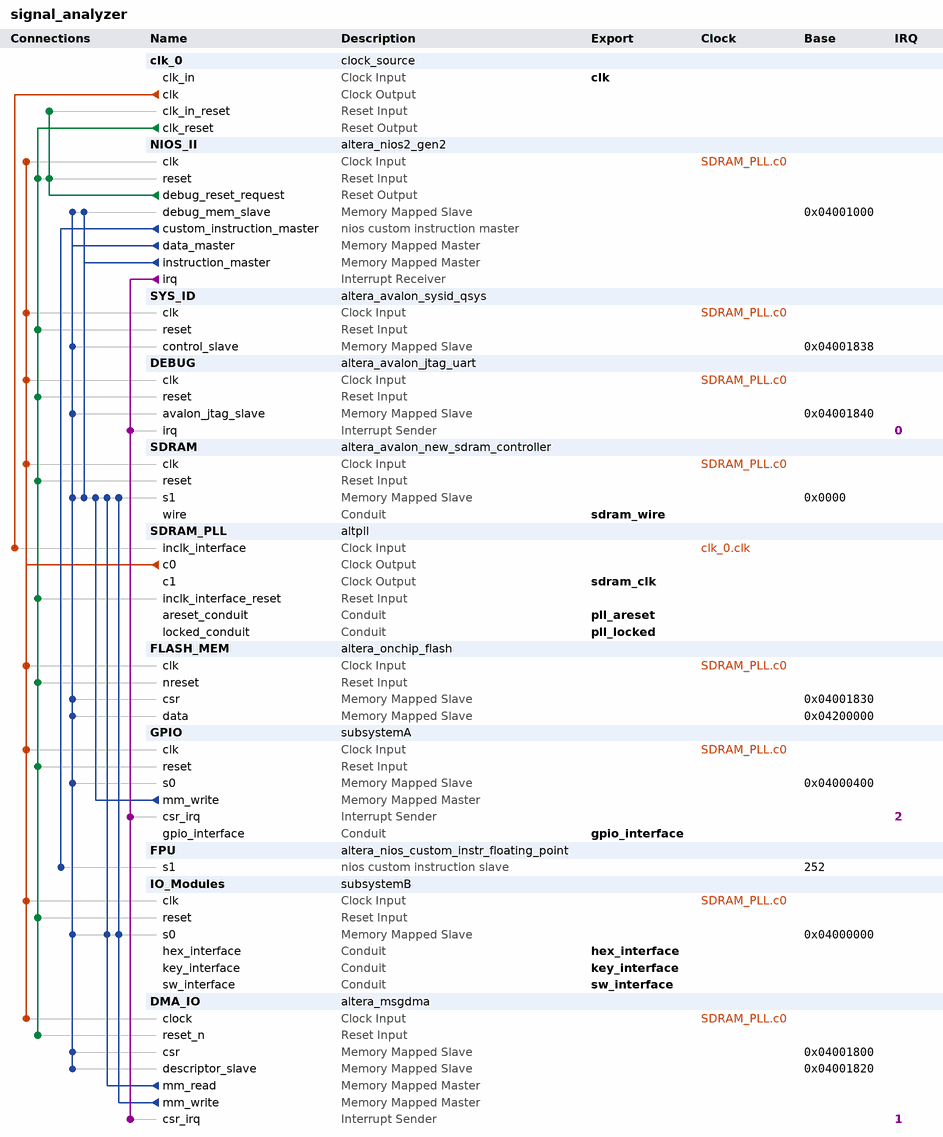
[diagram p0: system contents]
# Platform Designer (Qsys) system signal_analyzer, MAX 10 10M50DAF484C7G
# Parameters at their usual value, and those the tool derives, are not listed.
package require -exact qsys 18.1
create_system signal_analyzer
set_project_property DEVICE_FAMILY {MAX 10}
set_project_property DEVICE 10M50DAF484C7G

add_instance clk_0 clock_source 18.1
set_instance_parameter_value clk_0 clockFrequency 50000000

add_instance NIOS_II altera_nios2_gen2 18.1
set_instance_parameter_value NIOS_II dcache_size 2048
set_instance_parameter_value NIOS_II exceptionSlave SDRAM.s1
set_instance_parameter_value NIOS_II icache_size 4096
set_instance_parameter_value NIOS_II impl Fast
set_instance_parameter_value NIOS_II resetSlave SDRAM.s1

add_instance SYS_ID altera_avalon_sysid_qsys 18.1
set_instance_parameter_value SYS_ID id 0

add_instance DEBUG altera_avalon_jtag_uart 18.1
set_instance_parameter_value DEBUG simInteractiveOptions NO_INTERACTIVE_WINDOWS

add_instance SDRAM altera_avalon_new_sdram_controller 18.1
set_instance_parameter_value SDRAM TAC 5.5
set_instance_parameter_value SDRAM TRCD 20.0
set_instance_parameter_value SDRAM TRP 20.0
set_instance_parameter_value SDRAM casLatency 3
set_instance_parameter_value SDRAM columnWidth 10
set_instance_parameter_value SDRAM dataWidth 16
set_instance_parameter_value SDRAM generateSimulationModel false
set_instance_parameter_value SDRAM model single_Micron_MT48LC4M32B2_7_chip
set_instance_parameter_value SDRAM numberOfBanks 4
set_instance_parameter_value SDRAM numberOfChipSelects 1
set_instance_parameter_value SDRAM powerUpDelay 100.0
set_instance_parameter_value SDRAM refreshPeriod 15.625
set_instance_parameter_value SDRAM rowWidth 13

add_instance SDRAM_PLL altpll 18.1
set_instance_parameter_value SDRAM_PLL CLK0_DIVIDE_BY 1
set_instance_parameter_value SDRAM_PLL CLK0_MULTIPLY_BY 1
set_instance_parameter_value SDRAM_PLL CLK1_DIVIDE_BY 1
set_instance_parameter_value SDRAM_PLL CLK1_DUTY_CYCLE 50
set_instance_parameter_value SDRAM_PLL CLK1_MULTIPLY_BY 1
set_instance_parameter_value SDRAM_PLL CLK1_PHASE_SHIFT -3000
set_instance_parameter_value SDRAM_PLL INCLK0_INPUT_FREQUENCY 20000
set_instance_parameter_value SDRAM_PLL PORT_ARESET PORT_USED
set_instance_parameter_value SDRAM_PLL PORT_LOCKED PORT_USED
set_instance_parameter_value SDRAM_PLL PORT_clk1 PORT_USED
set_instance_parameter_value SDRAM_PLL PORT_clk2 PORT_UNUSED
set_instance_parameter_value SDRAM_PLL PORT_clk3 PORT_UNUSED

add_instance FLASH_MEM altera_onchip_flash 18.1
set_instance_parameter_value FLASH_MEM CLOCK_FREQUENCY 50.0
set_instance_parameter_value FLASH_MEM CONFIGURATION_MODE {Single Uncompressed Image with Memory Initialization}
set_instance_parameter_value FLASH_MEM SECTOR_ACCESS_MODE {Read and write,Read and write,Read and write,Read and write,Read and write}
set_instance_parameter_value FLASH_MEM initFlashContent false
set_instance_parameter_value FLASH_MEM initializationFileName altera_onchip_flash.hex
set_instance_parameter_value FLASH_MEM useNonDefaultInitFile false

add_instance GPIO subsystemA 1.0

add_instance FPU altera_nios_custom_instr_floating_point 18.1

add_instance IO_Modules subsystemB 1.0

add_instance DMA_IO altera_msgdma 18.1
set_instance_parameter_value DMA_IO BURST_ENABLE 0
set_instance_parameter_value DMA_IO DATA_FIFO_DEPTH 32
set_instance_parameter_value DMA_IO DATA_WIDTH 32
set_instance_parameter_value DMA_IO DESCRIPTOR_FIFO_DEPTH 128
set_instance_parameter_value DMA_IO ENHANCED_FEATURES 0
set_instance_parameter_value DMA_IO ERROR_ENABLE 0
set_instance_parameter_value DMA_IO MAX_BURST_COUNT 2
set_instance_parameter_value DMA_IO MAX_BYTE 65536
set_instance_parameter_value DMA_IO MODE 0
set_instance_parameter_value DMA_IO PACKET_ENABLE 0
set_instance_parameter_value DMA_IO TRANSFER_TYPE {Aligned Accesses}

# connections
add_connection clk_0.clk SDRAM_PLL.inclk_interface clock
add_connection SDRAM_PLL.c0 DEBUG.clk clock
add_connection SDRAM_PLL.c0 DMA_IO.clock clock
add_connection SDRAM_PLL.c0 FLASH_MEM.clk clock
add_connection SDRAM_PLL.c0 GPIO.clk clock
add_connection SDRAM_PLL.c0 IO_Modules.clk clock
add_connection SDRAM_PLL.c0 NIOS_II.clk clock
add_connection SDRAM_PLL.c0 SDRAM.clk clock
add_connection SDRAM_PLL.c0 SYS_ID.clk clock
add_connection clk_0.clk_reset DEBUG.reset reset
add_connection clk_0.clk_reset DMA_IO.reset_n reset
add_connection clk_0.clk_reset FLASH_MEM.nreset reset
add_connection clk_0.clk_reset GPIO.reset reset
add_connection clk_0.clk_reset IO_Modules.reset reset
add_connection clk_0.clk_reset NIOS_II.reset reset
add_connection clk_0.clk_reset SDRAM.reset reset
add_connection clk_0.clk_reset SDRAM_PLL.inclk_interface_reset reset
add_connection clk_0.clk_reset SYS_ID.reset reset
add_connection NIOS_II.debug_reset_request clk_0.clk_in_reset reset
add_connection NIOS_II.debug_reset_request NIOS_II.reset reset
add_connection DMA_IO.mm_read IO_Modules.s0 avalon
set_connection_parameter_value DMA_IO.mm_read/IO_Modules.s0 baseAddress 0x04000000
add_connection DMA_IO.mm_read SDRAM.s1 avalon
set_connection_parameter_value DMA_IO.mm_read/SDRAM.s1 baseAddress 0x0000
add_connection DMA_IO.mm_write IO_Modules.s0 avalon
set_connection_parameter_value DMA_IO.mm_write/IO_Modules.s0 baseAddress 0x04000000
add_connection DMA_IO.mm_write SDRAM.s1 avalon
set_connection_parameter_value DMA_IO.mm_write/SDRAM.s1 baseAddress 0x0000
add_connection GPIO.mm_write SDRAM.s1 avalon
set_connection_parameter_value GPIO.mm_write/SDRAM.s1 baseAddress 0x0000
add_connection NIOS_II.data_master DEBUG.avalon_jtag_slave avalon
set_connection_parameter_value NIOS_II.data_master/DEBUG.avalon_jtag_slave baseAddress 0x04001840
add_connection NIOS_II.data_master DMA_IO.csr avalon
set_connection_parameter_value NIOS_II.data_master/DMA_IO.csr baseAddress 0x04001800
add_connection NIOS_II.data_master DMA_IO.descriptor_slave avalon
set_connection_parameter_value NIOS_II.data_master/DMA_IO.descriptor_slave baseAddress 0x04001820
add_connection NIOS_II.data_master FLASH_MEM.csr avalon
set_connection_parameter_value NIOS_II.data_master/FLASH_MEM.csr baseAddress 0x04001830
add_connection NIOS_II.data_master FLASH_MEM.data avalon
set_connection_parameter_value NIOS_II.data_master/FLASH_MEM.data baseAddress 0x04200000
add_connection NIOS_II.data_master GPIO.s0 avalon
set_connection_parameter_value NIOS_II.data_master/GPIO.s0 baseAddress 0x04000400
add_connection NIOS_II.data_master IO_Modules.s0 avalon
set_connection_parameter_value NIOS_II.data_master/IO_Modules.s0 baseAddress 0x04000000
add_connection NIOS_II.data_master NIOS_II.debug_mem_slave avalon
set_connection_parameter_value NIOS_II.data_master/NIOS_II.debug_mem_slave baseAddress 0x04001000
add_connection NIOS_II.data_master SDRAM.s1 avalon
set_connection_parameter_value NIOS_II.data_master/SDRAM.s1 baseAddress 0x0000
add_connection NIOS_II.data_master SYS_ID.control_slave avalon
set_connection_parameter_value NIOS_II.data_master/SYS_ID.control_slave baseAddress 0x04001838
add_connection NIOS_II.instruction_master NIOS_II.debug_mem_slave avalon
set_connection_parameter_value NIOS_II.instruction_master/NIOS_II.debug_mem_slave baseAddress 0x04001000
add_connection NIOS_II.instruction_master SDRAM.s1 avalon
set_connection_parameter_value NIOS_II.instruction_master/SDRAM.s1 baseAddress 0x0000
add_connection NIOS_II.irq DEBUG.irq interrupt
set_connection_parameter_value NIOS_II.irq/DEBUG.irq irqNumber 0
add_connection NIOS_II.irq DMA_IO.csr_irq interrupt
set_connection_parameter_value NIOS_II.irq/DMA_IO.csr_irq irqNumber 1
add_connection NIOS_II.irq GPIO.csr_irq interrupt
set_connection_parameter_value NIOS_II.irq/GPIO.csr_irq irqNumber 2
add_connection NIOS_II.custom_instruction_master FPU.s1 nios_custom_instruction
set_connection_parameter_value NIOS_II.custom_instruction_master/FPU.s1 CIName fpu
set_connection_parameter_value NIOS_II.custom_instruction_master/FPU.s1 baseAddress 252

# exported interfaces
add_interface clk clock sink
set_interface_property clk EXPORT_OF clk_0.clk_in
add_interface gpio_interface conduit end
set_interface_property gpio_interface EXPORT_OF GPIO.gpio_interface
add_interface hex_interface conduit end
set_interface_property hex_interface EXPORT_OF IO_Modules.hex_interface
add_interface key_interface conduit end
set_interface_property key_interface EXPORT_OF IO_Modules.key_interface
add_interface pll_areset conduit end
set_interface_property pll_areset EXPORT_OF SDRAM_PLL.areset_conduit
add_interface pll_locked conduit end
set_interface_property pll_locked EXPORT_OF SDRAM_PLL.locked_conduit
add_interface sdram_clk clock source
set_interface_property sdram_clk EXPORT_OF SDRAM_PLL.c1
add_interface sdram_wire conduit end
set_interface_property sdram_wire EXPORT_OF SDRAM.wire
add_interface sw_interface conduit end
set_interface_property sw_interface EXPORT_OF IO_Modules.sw_interface

set_interconnect_requirement {$system} qsys_mm.clockCrossingAdapter HANDSHAKE
set_interconnect_requirement {$system} qsys_mm.enableEccProtection FALSE
set_interconnect_requirement {$system} qsys_mm.insertDefaultSlave FALSE
set_interconnect_requirement {$system} qsys_mm.maxAdditionalLatency 1

save_system signal_analyzer.qsys
